# Altium schematic sheet Channel - EX.SchDoc
size A; SheetNumber: 10; SheetTotal: 10
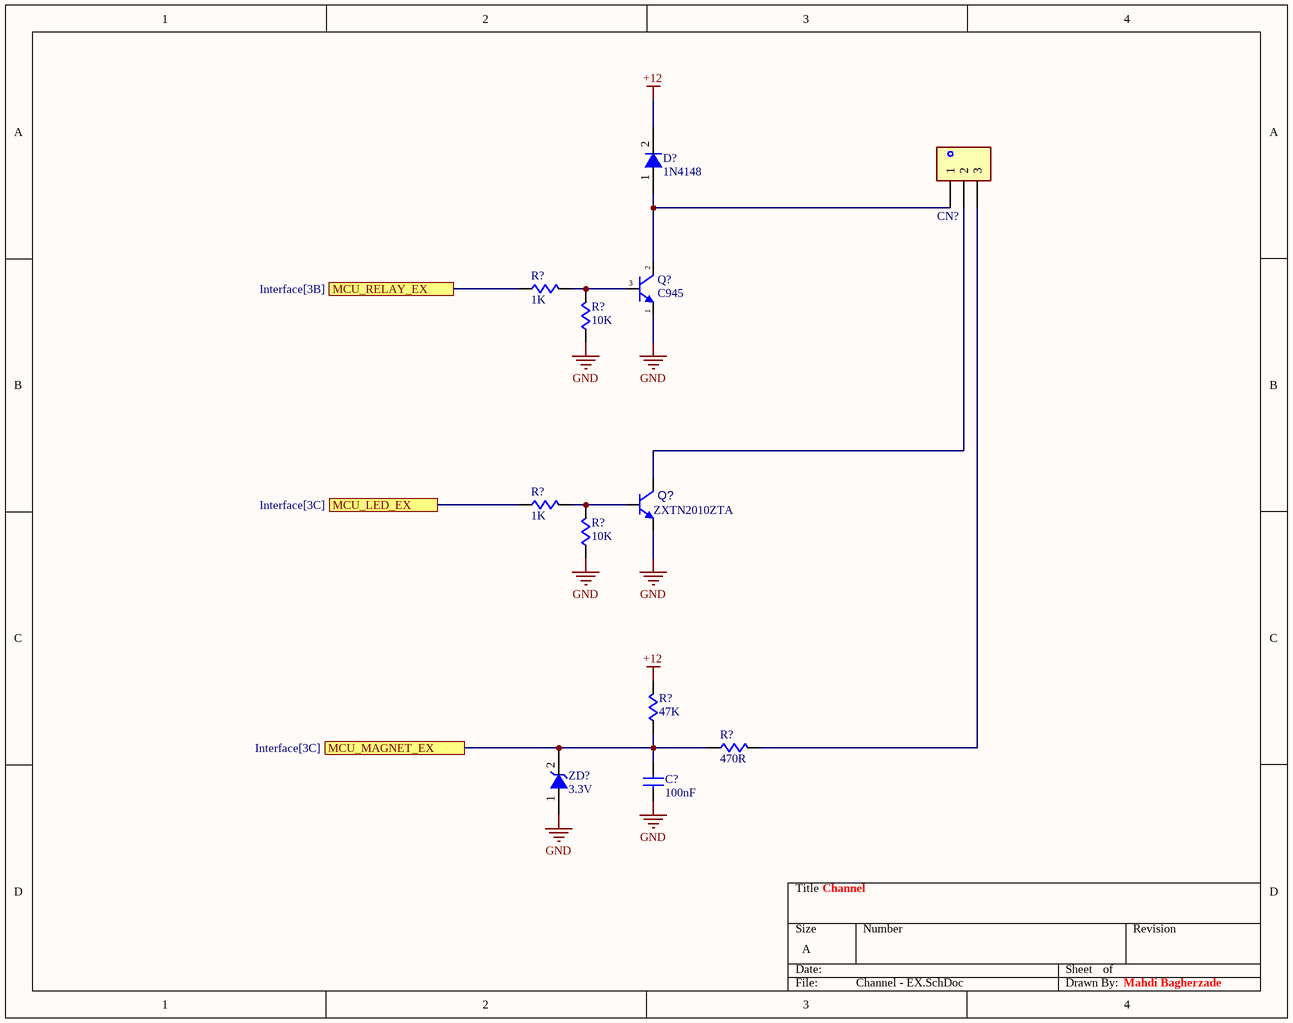
[diagram p0: Channel - EX.SchDoc]

## Parts
(Parts that share a designator on the sheet are numbered #1, #2 ... from top to bottom, then left to right.)
C?  value 100nF  [C-0805]
CN?  Connector XH/VH/TE-Straight/Right-THD/SMD-?mm  [XH-3]  (value not drawn)
D?  Code: 1N4148  [SOD123]  (hidden comment: Diode 1N4148-SMD)
Q?#1  value C945  [SOT23-312]  (hidden comment: TR C945-SMD)
Q?#2  value ZXTN2010ZTA  [SOT89-V02]  (hidden comment: TR ZXTN2010ZTA-SMD)
R?#1  value 1K  [R-0805]  (hidden comment: RES 1K-5%-1/8W-SMD)
R?#2  value 10K  [R-0805]  (hidden comment: RES 10K-5%-1/8W-SMD)
R?#3  value 1K  [R-0805]  (hidden comment: RES 1K-5%-1/8W-SMD)
R?#4  value 10K  [R-0805]  (hidden comment: RES 10K-5%-1/8W-SMD)
R?#5  value 47K  [R-0805]
R?#6  value 470R  [R-0805]
ZD?  Voltage: 3.3V  [SOD80]  (hidden comment: Zener -3.3V-SMD)

## Ports
MCU_LED_EX (see Interface[3C]), MCU_MAGNET_EX (see Interface[3C]), MCU_RELAY_EX (see Interface[3B])

## Nets
+12: D?.2(C) R?#5.1
GND: C?.2 Q?#1.1(E) Q?#2.3(E) R?#2.1 R?#4.1 ZD?.1(A)
MCU_LED_EX: R?#3.1 ; port MCU_LED_EX
MCU_MAGNET_EX: C?.1 R?#5.2 R?#6.2 ZD?.2(C) ; port MCU_MAGNET_EX
MCU_RELAY_EX: R?#1.1 ; port MCU_RELAY_EX
NetCN?_1: CN?.1 D?.1(A) Q?#1.2(C)
NetCN?_2: CN?.2 Q?#2.2(C)
NetCN?_3: CN?.3 R?#6.1
NetQ?#1_3: Q?#1.3(B) R?#1.2 R?#2.2
NetQ?#2_1: Q?#2.1(B) R?#3.2 R?#4.2

## Notes on the sheet
- Channel
- Mahdi Bagherzade

## Library data of the parts
C? = CAP-BIPOLAR: CAPACITOR; Phone Number: 0915 8700 314; Voltage: 50V; Publisher: Mahdi Bagherzadeh; ComponentLink1Description: Linkedin; ComponentLink1URL: https://ir.linkedin.com/in/mahdi-bagherzade; Published Date: 9-15-2024; Size: 0805
CN? = CN-3pin: CONNECTOR; Phone Number: 0915 8700 314; Publisher: Mahdi Bagherzadeh; ComponentLink1Description: Linkedin; ComponentLink1URL: https://ir.linkedin.com/in/mahdi-bagherzade; Published Date: 9-15-2024; Type: Straight/Right-THD/SMD; Size: ?mm; Value: XH/VH/TE
D? = DIODE: Phone Number: 0915 8700 314; Type: SMD; Publisher: Mahdi Bagherzadeh; ComponentLink1Description: Linkedin; ComponentLink1URL: https://ir.linkedin.com/in/mahdi-bagherzade; Published Date: 9-15-2024
Q?#1 = C945: TRANSISTOR; Phone Number: 0915 8700 314; Code: CR; Type: SMD; Publisher: Mahdi Bagherzadeh; ComponentLink1Description: Linkedin; ComponentLink1URL: https://ir.linkedin.com/in/mahdi-bagherzade; Published Date: 9-15-2024
Q?#2 = ZXTN2010ZTA: TRANSISTOR; Phone Number: 0; Type: SMD; Publisher: Fatemeh Imani; ComponentLink1Description: New link; ComponentLink1URL: *; Published Date: 1-6-2026
R?#1-R?#6 = RES: RESISTOR; Phone Number: 0915 8700 314; Tolerance: 5%; Power: 1/8W; Publisher: Mahdi Bagherzadeh; ComponentLink1Description: Linkedin; ComponentLink1URL: https://ir.linkedin.com/in/mahdi-bagherzade; Published Date: 9-15-2024
  R?#1-R?#4: Type: SMD
ZD? = DIODE-ZENER: DIODE; Phone Number: 0915 8700 314; Power: Minimelf; Publisher: Mahdi Bagherzadeh; ComponentLink1Description: Linkedin; ComponentLink1URL: https://ir.linkedin.com/in/mahdi-bagherzade; Published Date: 9-15-2024; Type: SMD